# Altium schematic sheet USB.SchDoc: USB
size A4; Date: Not used; ApprovedBy: Not used; CheckedBy: Not used; Author: Not used; CompanyName: STMicroelectronics; DrawnBy: Not used; Engineer: Not used; Organization: Not used; Address1: Not used; Address2: Not used; Address3: Not used; Address4: Not used; DocumentNumber: 7; Revision: Not used; SheetNumber: 7; SheetTotal: 8; CurrentTime: Not used; CurrentDate: Not used; Time: Not used; DocumentFullPathAndName: Not used; DocumentName: Not used; ModifiedDate: Not used; ImagePath: Not used; ProjectName: Not used; Application_BuildNumber: Not used
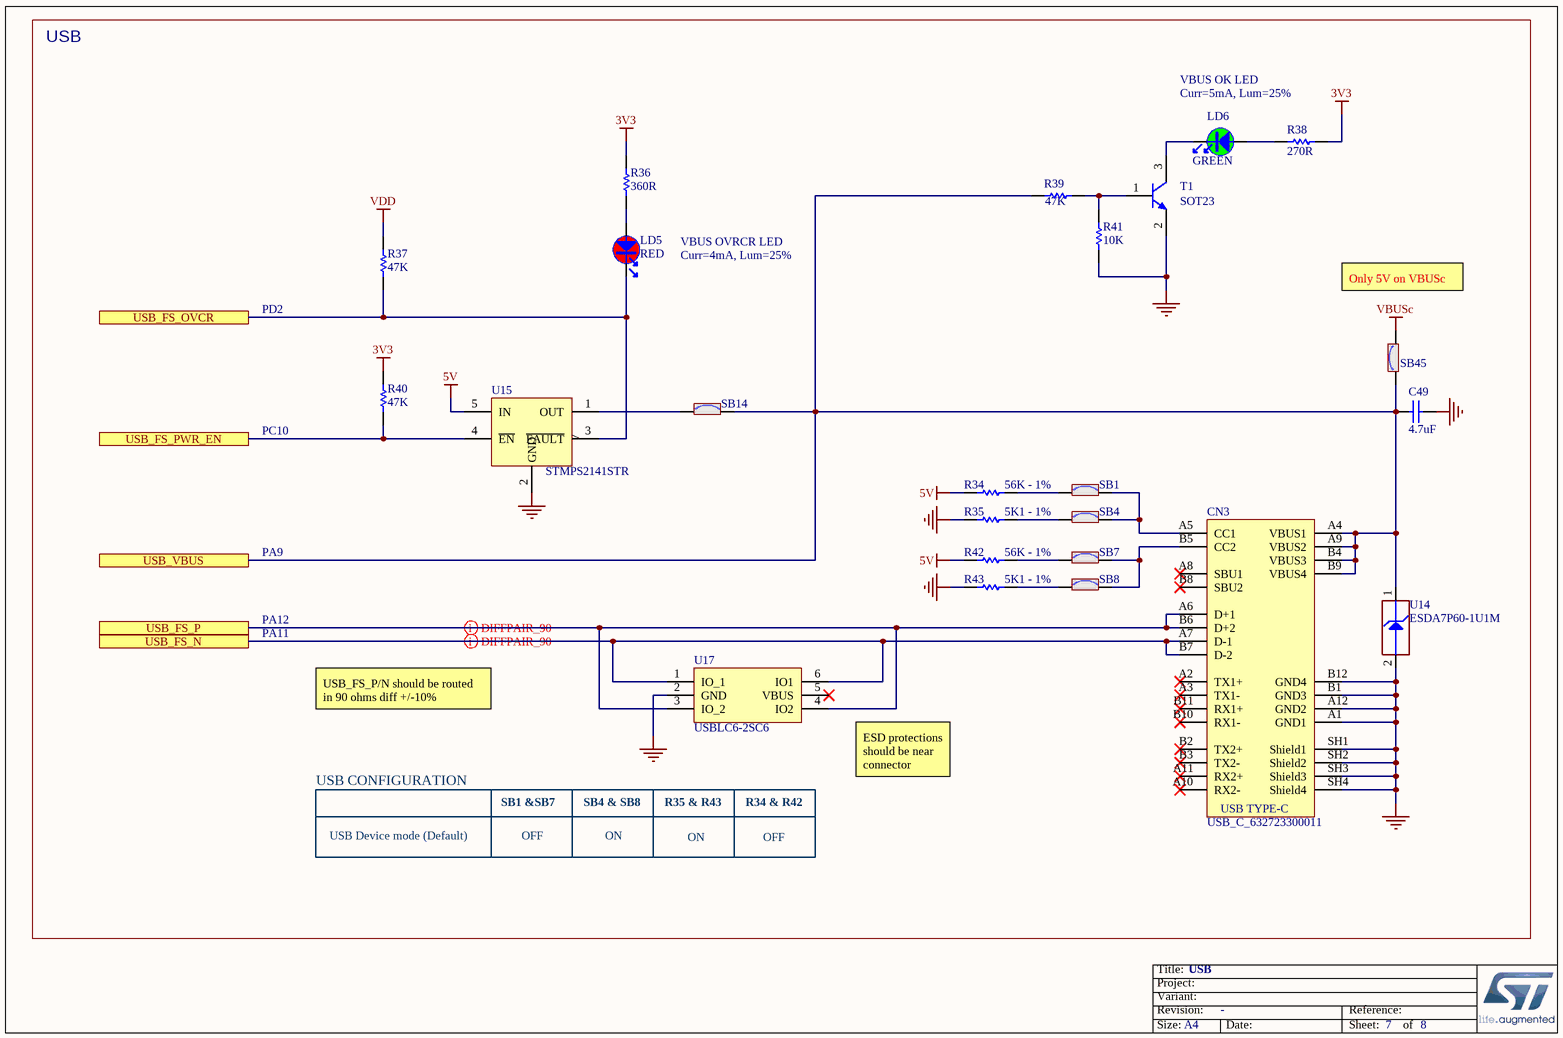
[diagram p0: USB.SchDoc]

## Parts
C49  value 4.7uF  [C0603]  (hidden comment: Capacitor)
CN3  value USB_C_632723300011  [CON_USB-TYPEC_WE_632723300011]  (hidden comment: USB_TYPE_C_Receptacle)
LD5  value RED  [LED_0603_VISHAY_VLMS1300-GS08_RED_1A2K_H0P8]  (hidden comment: LED_red)
LD6  value GREEN  [LED_0603_OSRAM_LG-Q396-PS-35_GREEN_1A2K_H0P4]  (hidden comment: LED_green)
R34  value 56K - 1%  [R0603]  (hidden comment: Resistor)
R35  value 5K1 - 1%  [R0603]  (hidden comment: Resistor)
R36  value 360R  [R0402]  (hidden comment: Resistor)
R37  value 47K  [R0402]  (hidden comment: Resistor)
R38  value 270R  [R0402]  (hidden comment: Resistor)
R39  value 47K  [R0402]  (hidden comment: Resistor)
R40  value 47K  [R0402]  (hidden comment: Resistor)
R41  value 10K  [R0402]  (hidden comment: Resistor)
R42  value 56K - 1%  [R0603]  (hidden comment: Resistor)
R43  value 5K1 - 1%  [R0603]  (hidden comment: Resistor)
SB1  (no value)  [SOLDER-BRIDGE_R0603-0R]
SB4  (no value)  [SOLDER-BRIDGE_R0603-0R]
SB7  (no value)  [SOLDER-BRIDGE_R0603-0R]
SB8  (no value)  [SOLDER-BRIDGE_R0603-0R]
SB14  (no value)  [SOLDER-BRIDGE_R0603-0R]
SB45  (no value)  [SOLDER-BRIDGE_R0603-0R]
T1  value SOT23  [NPN_SOT23]  (hidden comment: 9013-SOT23)
U14  value ESDA7P60-1U1M  [ESD_QFN2_1P6X1_P125]  (hidden comment: ESD-TRANSIL)
U15  STMPS2141STR  [MOS_SOT23-5L]
U17  USBLC6-2SC6  [ESD_SOT23-6L]

## Ports
USB_FS_N, USB_FS_OVCR, USB_FS_P, USB_FS_PWR_EN, USB_VBUS

## Nets
3V3: R36.2 R38.2 R40.1
5V: R34.1 R42.1 U15.5(IN)
GND: C49.1 CN3.A1(GND1) CN3.A12(GND2) CN3.B1(GND3) CN3.B12(GND4) CN3.SH1(Shield1) CN3.SH2(Shield2) CN3.SH3(Shield3) CN3.SH4(Shield4) R35.1 R41.1 R43.1 T1.2(E) U14.2(GND) U15.2(GND) U17.2(GND)
VBUSc: SB45.2
VDD: R37.1
USB_FS_N: CN3.A7(D-1) CN3.B7(D-2) U17.1(IO_1) U17.6(IO1) ; port USB_FS_N
USB_FS_OVCR: LD5.2 R37.2 U15.3(~{FAULT}) ; port USB_FS_OVCR
USB_FS_P: CN3.A6(D+1) CN3.B6(D+2) U17.3(IO_2) U17.4(IO2) ; port USB_FS_P
USB_FS_PWR_EN: R40.2 U15.4(~{EN}) ; port USB_FS_PWR_EN
USB_VBUS: C49.2 CN3.A4(VBUS1) CN3.A9(VBUS2) CN3.B4(VBUS3) CN3.B9(VBUS4) R39.1 SB14.2 SB45.1 U14.1(IO1) ; port USB_VBUS
NetCN3_A5: CN3.A5(CC1) SB1.2 SB4.2
NetCN3_B5: CN3.B5(CC2) SB7.2 SB8.2
NetLD5_1: LD5.1 R36.1
NetLD6_1: LD6.1 R38.1
NetLD6_2: LD6.2 T1.3(C)
NetR34_2: R34.2 SB1.1
NetR35_2: R35.2 SB4.1
NetR39_2: R39.2 R41.2 T1.1(B)
NetR42_2: R42.2 SB7.1
NetR43_2: R43.2 SB8.1
NetSB14_1: SB14.1 U15.1(OUT)

Not connected (* = marked no-connect by the designer): CN3 A2(TX1+)* A3(TX1-)* A8(SBU1)* A10(RX2-)* A11(RX2+)* B2(TX2+)* B3(TX2-)* B8(SBU2)* B10(RX1-)* B11(RX1+)*; U17 5(VBUS)*

## Layout directives
differential pair: USB_FS_N, USB_FS_P

## Notes on the sheet
- USB
- VBUS OK LED
- Curr=5mA, Lum=25%
- VBUS OVRCR LED
- PD2
- Curr=4mA, Lum=25%
- Only 5V on VBUSc
- PC10
- PA9
- PA11
- PA12
- USB_FS_P/N should be routed in 90 ohms diff +/-10%
- USB CONFIGURATION
- ESD protections should be near connector
- USB Device mode (Default)
- SB1 &SB7
- OFF
- SB4 & SB8
- ON
- R35 & R43
- R34 & R42
- Title:
- Project:
- Size:
- Revision:
- Variant:
- A4
- -
- Date:
- Reference:
- Sheet:
- of
- (in symbol MCD-02273) USB TYPE-C

## Library data of the parts
C49 = MCD-00009: Capacitor, MLCC, 4.7uF, 16V, X5R, 10%, 0603, T=0.8mm; Manufacturer_Part_Number: CC0603KRX5R7BB475; Manufacturer: YAGEO; Provided_By: SUBCO; ECCN_US: EAR99; ECCN_EU: NEC; Internal_Part_Number: MCD-00009; ComponentLink1Description: Datasheet; Status: Released; Package: C0603; Part_Type: Capacitor; ComponentLink1URL: http://tunmcdsvn.tun.st.com/Component_Datasheet_Library/Trunk/Capacitors/Yageo_Multilayer_capacitor_X5R_series_100pF_to_100uF
CN3 = MCD-02273: USB_TypeC, 24pins, RA, TH, T=1.9mm (USB certified); Part_Type: Connector; Part_Preference: Recommended; Manufacturer: WURTH ELEKTRONIK; Manufacturer_Part_Number: 632723300011; Component_Country_Of_Origin: China; ShowFields: YES; ID: 4373; Internal_Part_Number: MCD-02273; Status: Released; ComponentLink1URL: http://tunmcdsvn.tun.st.com/Component_Datasheet_Library/Trunk/Connectors/WURTH_ELEKTRONIK_USB_TYPE-C_632723300011; Order_Code_Digikey: 732-9618-1-ND; Order_Code_Farnell: 2984404; Order_Code_RS: N/A
LD5 = MCD-00587: LED Red, 0603 SMD, 2V Forward Voltage; Part_Type: Display; Manufacturer_Part_Number: VLMS1300-GS08; Manufacturer: VISHAY; Alternate_Manufacturer_Part_Number: LS Q976-NR-1; Alternate_Manufacturer: OSRAM OPTO SEMICONDUCTORS; Provided_By: SUBCO; Internal_Part_Number: MCD-00587; Status: Released; Package: LED 0603; ComponentLink1Description: Datasheet; ComponentLink1URL: http://tunmcdsvn.tun.st.com/Component_Datasheet_Library/Trunk/Display/VISHAY_LED_RED_VLMS1300-GS08; Order_Code_Digikey: VLMS1300-GS08CT-ND; Order_Code_Farnell: 2078728; ECCN_US: n/a; ECCN_EU: n/a
LD6 = MCD-00588: LED Green, 0603 SMD, Forward Voltage Typ=2V, Max=2.5V; Part_Type: Display; Manufacturer_Part_Number: LG Q396-PS-35; Manufacturer: OSRAM OPTO SEMICONDUCTORS; Alternate_Manufacturer_Part_Number: VLMTG1300-GS08; Alternate_Manufacturer: VISHAY SEMICONDUCTOR OPTO DIVISION; Provided_By: SUBCO; Internal_Part_Number: MCD-00588; Status: Released; Package: LED 0603; ComponentLink1Description: Datasheet; ComponentLink1URL: http://tunmcdsvn.tun.st.com/Component_Datasheet_Library/Trunk/Display/OSRAM_LED_GREEN_LG Q396-PS-35; Order_Code_Digikey: LG Q396-PS-35-ND; ECCN_US: n/a; ECCN_EU: n/a
R34 R42 = MCD-00494: Resistor, 56K, 0603, +/-1%, 1/10W; Part_Preference: Recommended; Manufacturer: YAGEO; Manufacturer_Part_Number: RC0603FR-0756KL; Internal_Part_Number: MCD-00494; Status: Released; Part_Type: Resistor; Alternate_Manufacturer: N/A; Alternate_Manufacturer_Part_Number: N/A; Package: 0603; ComponentLink1URL: http://tunmcdsvn.tun.st.com/Component_Documentation_Library/Trunk/Resistor/YAGEO_RC_L_Series; Order_Code_Digikey: 311-56KHRCT-ND; Order_Code_Farnell: 9238697; Order_Code_RS: N/A
R35 R43 = MCD-00334: Resistor, 5K1, 0603, +/-1%, 1/10W; Part_Preference: Recommended; Manufacturer: YAGEO; Manufacturer_Part_Number: RC0603FR-075K1L; Internal_Part_Number: MCD-00334; Status: Released; Part_Type: Resistor; Alternate_Manufacturer: N/A; Alternate_Manufacturer_Part_Number: N/A; Package: 0603; ComponentLink1URL: http://tunmcdsvn.tun.st.com/Component_Documentation_Library/Trunk/Resistor/YAGEO_RC_L_Series; Order_Code_Digikey: 311-5.10KHRCT-ND; Order_Code_Farnell: 1799348; Order_Code_RS: N/A
R36 = MCD-00461: Resistor,360R,0402,1%,1/16W; Manufacturer_Part_Number: RC0402FR-07360RL; Manufacturer: YAGEO; Provided_By: SUBCO; ECCN_US: EAR99; ECCN_EU: NEC; Internal_Part_Number: MCD-00461; Status: Released; Part_Type: Resistor; Package: R0402; ComponentLink1Description: Datasheet; ComponentLink1URL: http://tunmcdsvn.tun.st.com/Component_Datasheet_Library/Trunk/Resistors/Yageo_Resistor_RC0402-series
R37 R39 R40 = MCD-00063: Resistor,47K,0402,1%,1/16W; Manufacturer_Part_Number: RC0402FR-0747KL; Manufacturer: YAGEO; Provided_By: SUBCO; ECCN_US: EAR99; ECCN_EU: NEC; Internal_Part_Number: MCD-00063; ComponentLink1Description: Datasheet; Status: Released; Part_Type: Resistor; Package: R0402; ComponentLink1URL: http://tunmcdsvn.tun.st.com/Component_Datasheet_Library/Trunk/Resistors/Yageo_Resistor_RC0402-series
R38 = MCD-00441: Resistor,270R,0402,1%,1/16W; Manufacturer_Part_Number: RC0402FR-07270RL; Manufacturer: YAGEO; Provided_By: SUBCO; ECCN_US: EAR99; ECCN_EU: NEC; Internal_Part_Number: MCD-00441; Status: Released; Part_Type: Resistor; Package: R0402; ComponentLink1Description: Datasheet; ComponentLink1URL: http://tunmcdsvn.tun.st.com/Component_Datasheet_Library/Trunk/Resistors/Yageo_Resistor_RC0402-series
R41 = MCD-00053: Resistor,10K,0402,1%,1/16W; Manufacturer_Part_Number: RC0402FR-0710KL; Manufacturer: YAGEO; Provided_By: SUBCO; ECCN_US: EAR99; ECCN_EU: NEC; Internal_Part_Number: MCD-00053; Status: Released; ComponentLink1Description: Datasheet; Part_Type: Resistor; Package: R0402; ComponentLink1URL: http://tunmcdsvn.tun.st.com/Component_Datasheet_Library/Trunk/Resistors/Yageo_Resistor_RC0402-series
SB1 SB4 SB7 SB8 SB14 SB45 = MCD-00071: Solder Bridge ON; Part_Type: Mechanical; Manufacturer_Part_Number: RC0603JR-070RL; Manufacturer: YAGEO; Provided_By: SUBCO; Internal_Part_Number: MCD-00071; ECCN_US: n/a; ECCN_EU: n/a; Status: Released; Package: SB0603; ComponentLink1Description: Datasheet; ComponentLink1URL: http://tunmcdsvn.tun.st.com/Component_Datasheet_Library/Trunk/Resistors/Yageo_Resistor_RC0603-series
T1 = MCD-00073: NPN Bipolar Transistor; Manufacturer_Part_Number: BSR14; Manufacturer: ON SEMICONDUCTOR; Part_Type: IC; Alternate_Manufacturer_Part_Number: MMBT2222ALT1G / MMBT2222ALT3G; Provided_By: SUBCO; ECCN_US: EAR99; ECCN_EU: NEC; Revision: *; Internal_Part_Number: MCD-00073; ComponentLink1Description: Datasheet; Status: Released; ComponentLink1URL: http://tunmcdsvn.tun.st.com/Component_Datasheet_Library/Trunk/IC/NXP_Transistor_BSR14; Alternate_Manufacturer: ON SEMICONDUCTOR
U14 = MCD-00251: High power transient voltage suppressor, 7V breakdown; BMS_Part_Number: 9179042; Part_Type: Diode; Part_Preference: Recommended; Manufacturer: STMICROELECTRONICS; Manufacturer_HQ_COO: EU; Internal_Part_Number: MCD-00251; Status: Released; Manufacturer_Part_Number: ESDA7P60-1U1M; ComponentLink1URL: http://tunmcdsvn.tun.st.com/Component_Datasheet_Library/Trunk/Diodes/STM_ESD_ESDA7P60-1U1M
U15 = MCD-00083: Enhanced single channel power switches with active low enable pin; Part_Type: IC; Manufacturer: STMICROELECTRONICS; Alternate_Manufacturer_Part_Number: TPS2041C; Alternate_Manufacturer: TEXAS INSTRUMENTS; BMS_Part_Number: 9159003; Provided_By: SUBCO with ST control; ECCN_US: EAR99; ECCN_EU: NEC; Internal_Part_Number: MCD-00083; Value: STMPS2141STR; Status: Released; Manufacturer_Part_Number: STMPS2141STR; ComponentLink1Description: Datasheet; ComponentLink1URL: http://tunmcdsvn.tun.st.com/Component_Datasheet_Library/Trunk/IC/STM_PWR-Switch_STMPS2141STR
U17 = MCD-00163: Very low capacitance ESD protection; Part_Type: IC; Manufacturer: STMICROELECTRONICS; BMS_Part_Number: 9151075; Provided_By: SUBCO with ST control; ECCN_US: EAR99; ECCN_EU: NEC; Internal_Part_Number: MCD-00163; Value: USBLC6-2SC6; Status: Released; Manufacturer_Part_Number: USBLC6-2SC6; ComponentLink1Description: Datasheet; ComponentLink1URL: http://tunmcdsvn.tun.st.com/Component_Datasheet_Library/Trunk/Diodes/STM_ESD_USBLC6-2